# Altium schematic sheet GSM.SchDoc
size A3
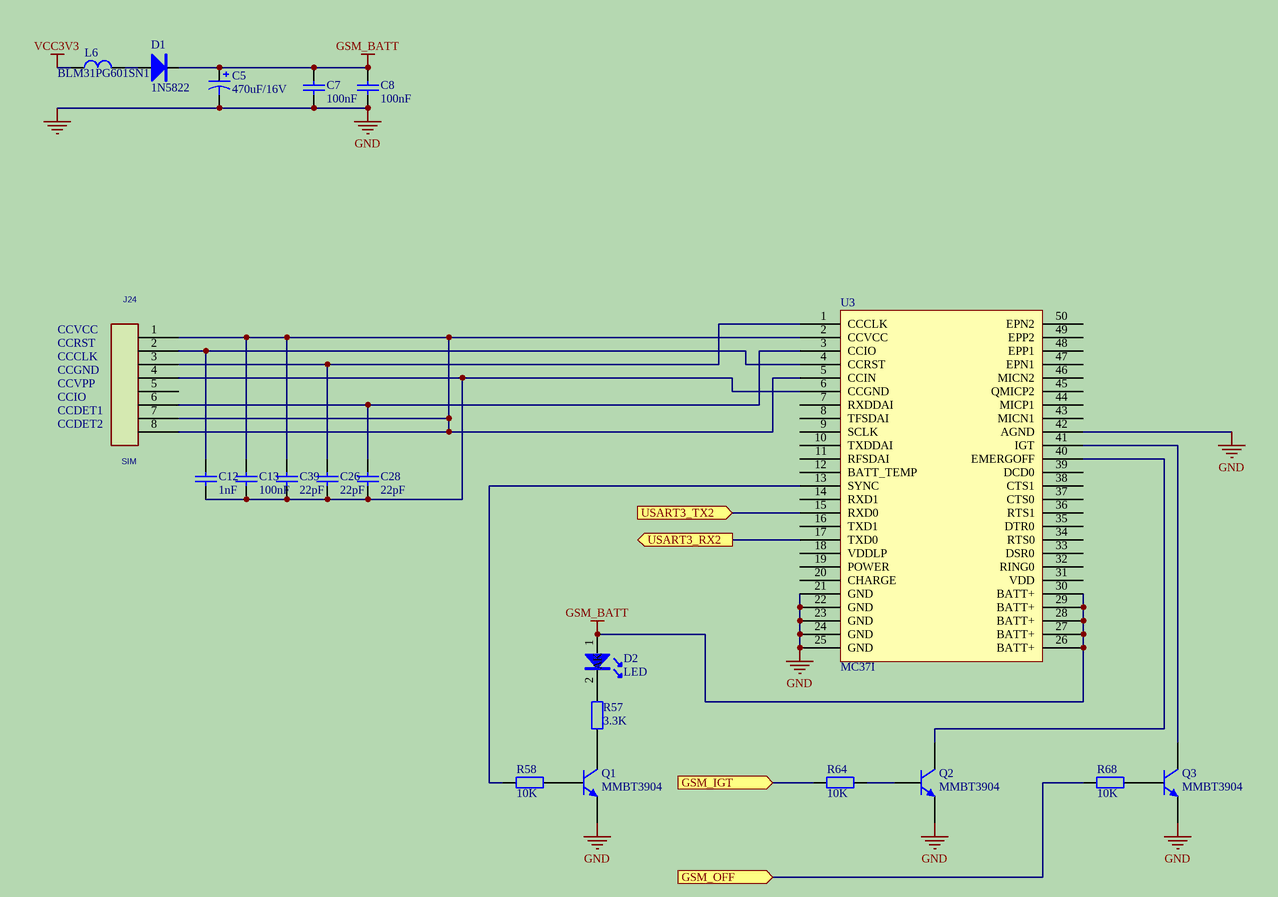
[diagram p0: GSM.SchDoc]

## Parts
C5  470uF/16V  [CD2/3]
C7  100nF  [C0805]
C8  100nF  [C0805]
C12  1nF  [C0805]
C13  100nF  [C0805]
C26  22pF  [C0805]
C28  22pF  [C0805]
C39  22pF  [C0805]
D1  1N5822  [V5]
D2  LED  [LED0805]
J24  SIM  [IC-CARD2]
L6  BLM31PG601SN1  [L1206]
Q1  MMBT3904  [SOT23_N]
Q2  MMBT3904  [SOT23_N]
Q3  MMBT3904  [SOT23_N]
R57  3.3K  [R0805]
R58  10K  [R0805]
R64  10K  [R0805]
R68  10K  [R0805]
U3  MC37I  [MC37I]

## Ports
GSM_IGT (in), GSM_OFF (in), USART3_RX2 (out), USART3_TX2 (in)

## Nets
GND: C5.2 C7.1 C8.1 Q1.2(E) Q2.2(E) Q3.2(E) U3.21(GND) U3.22(GND) U3.23(GND) U3.24(GND) U3.25(GND) U3.42(AGND)
GSM_BATT: C5.1 C7.2 C8.2 D1.2(K) D2.1(A) U3.26(BATT+) U3.27(BATT+) U3.28(BATT+) U3.29(BATT+) U3.30(BATT+)
VCC3V3: L6.1
GSM_IGT: R64.1 ; port GSM_IGT
GSM_OFF: R68.1 ; port GSM_OFF
USART3_RX2: U3.17(TXD0) ; port USART3_RX2
USART3_TX2: U3.15(RXD0) ; port USART3_TX2
NetC12_1: C12.1 C13.1 C26.1 C28.1 C39.1 J24.4 U3.6(CCGND)
NetC12_2: C12.2 J24.2 U3.4(CCRST)
NetC13_2: C13.2 C39.2 J24.1 J24.7 J24.8 U3.2(CCVCC) U3.5(CCIN)
NetC26_2: C26.2 J24.3 U3.1(CCCLK)
NetC28_2: C28.2 J24.6 U3.3(CCIO)
NetD1_1: D1.1(A) L6.2
NetD2_2: D2.2(K) R57.2
NetQ1_1: Q1.1(B) R58.2
NetQ1_3: Q1.3(C) R57.1
NetQ2_1: Q2.1(B) R64.2
NetQ2_3: Q2.3(C) U3.40(EMERGOFF)
NetQ3_1: Q3.1(B) R68.2
NetQ3_3: Q3.3(C) U3.41(IGT)
NetR58_1: R58.1 U3.13(SYNC)

Not connected (* = marked no-connect by the designer): J24 5; U3 7(RXDDAI) 8(TFSDAI) 9(SCLK) 10(TXDDAI) 11(RFSDAI) 12(BATT_TEMP) 14(RXD1) 16(TXD1) 18(VDDLP) 19(POWER) 20(CHARGE) 31(VDD) 32(RING0) 33(DSR0) 34(RTS0) 35(DTR0) 36(RTS1) 37(CTS0) 38(CTS1) 39(DCD0) 43(MICN1) 44(MICP1) 45(QMICP2) 46(MICN2) 47(EPN1) 48(EPP1) 49(EPP2) 50(EPN2)

## Notes on the sheet
- (near J24) CCVCC
- (near J24) CCRST
- (near J24) CCCLK
- (near J24) CCGND
- (near J24) CCVPP
- CCIO
- (near J24) CCDET1
- (near J24) CCDET2

## Library data of the parts
C5 = Cap Pol1: Polarized Capacitor (Radial); Value: 100pF; Published: 8-Jun-2000; LatestRevisionDate: 17-Jul-2002; LatestRevisionNote: Re-released for DXP Platform.; PackageReference: RB7.6-15; Publisher: Altium Limited
C7 C8 C12 C13 C26 C28 C39 = Cap: Capacitor; Value: 100pF; Published: 8-Jun-2000; LatestRevisionDate: 17-Jul-2002; LatestRevisionNote: Re-released for DXP Platform.; PackageReference: RAD-0.3; Publisher: Altium Limited
D1 = 2JG: Diode
J24 = CON8
L6 = L1
Q1-Q3 = MMBT3904: NPN Switching Transistor; Published: 17-Sep-2003; LatestRevisionDate: 12-Dec-2006; LatestRevisionNote: IPC-7351 Footprint Added.; DatasheetVersion: 13-May-2002; PackageVersion: May-1999; PackageReference: SOT23; Publisher: Altium Limited; PackageDescription: 3-Pin SOT-23 Package 0.95 mm Pitch, 2.3 mm Lead Span; ComponentLink1Description: Manufacturer Link; ComponentLink1URL: http://www.semiconductors.philips.com/; ComponentLink2Description: Datasheet; ComponentLink2URL: http://www.semiconductors.philips.com/acrobat/datasheets/MMBT3904_4.pdf
R57 = Res2: Resistor; Value: 10K; Published: 8-Jun-2000; LatestRevisionDate: 17-Jul-2002; LatestRevisionNote: Re-released for DXP Platform.; PackageReference: AXIAL-0.4; Publisher: Altium Limited
R58 R64 R68 = Res2: Resistor; Published: 8-Jun-2000; LatestRevisionDate: 17-Jul-2002; LatestRevisionNote: Re-released for DXP Platform.; PackageReference: AXIAL-0.4; Publisher: Altium Limited; Value: 10K